# Altium project 6S_BMS.PrjPcb
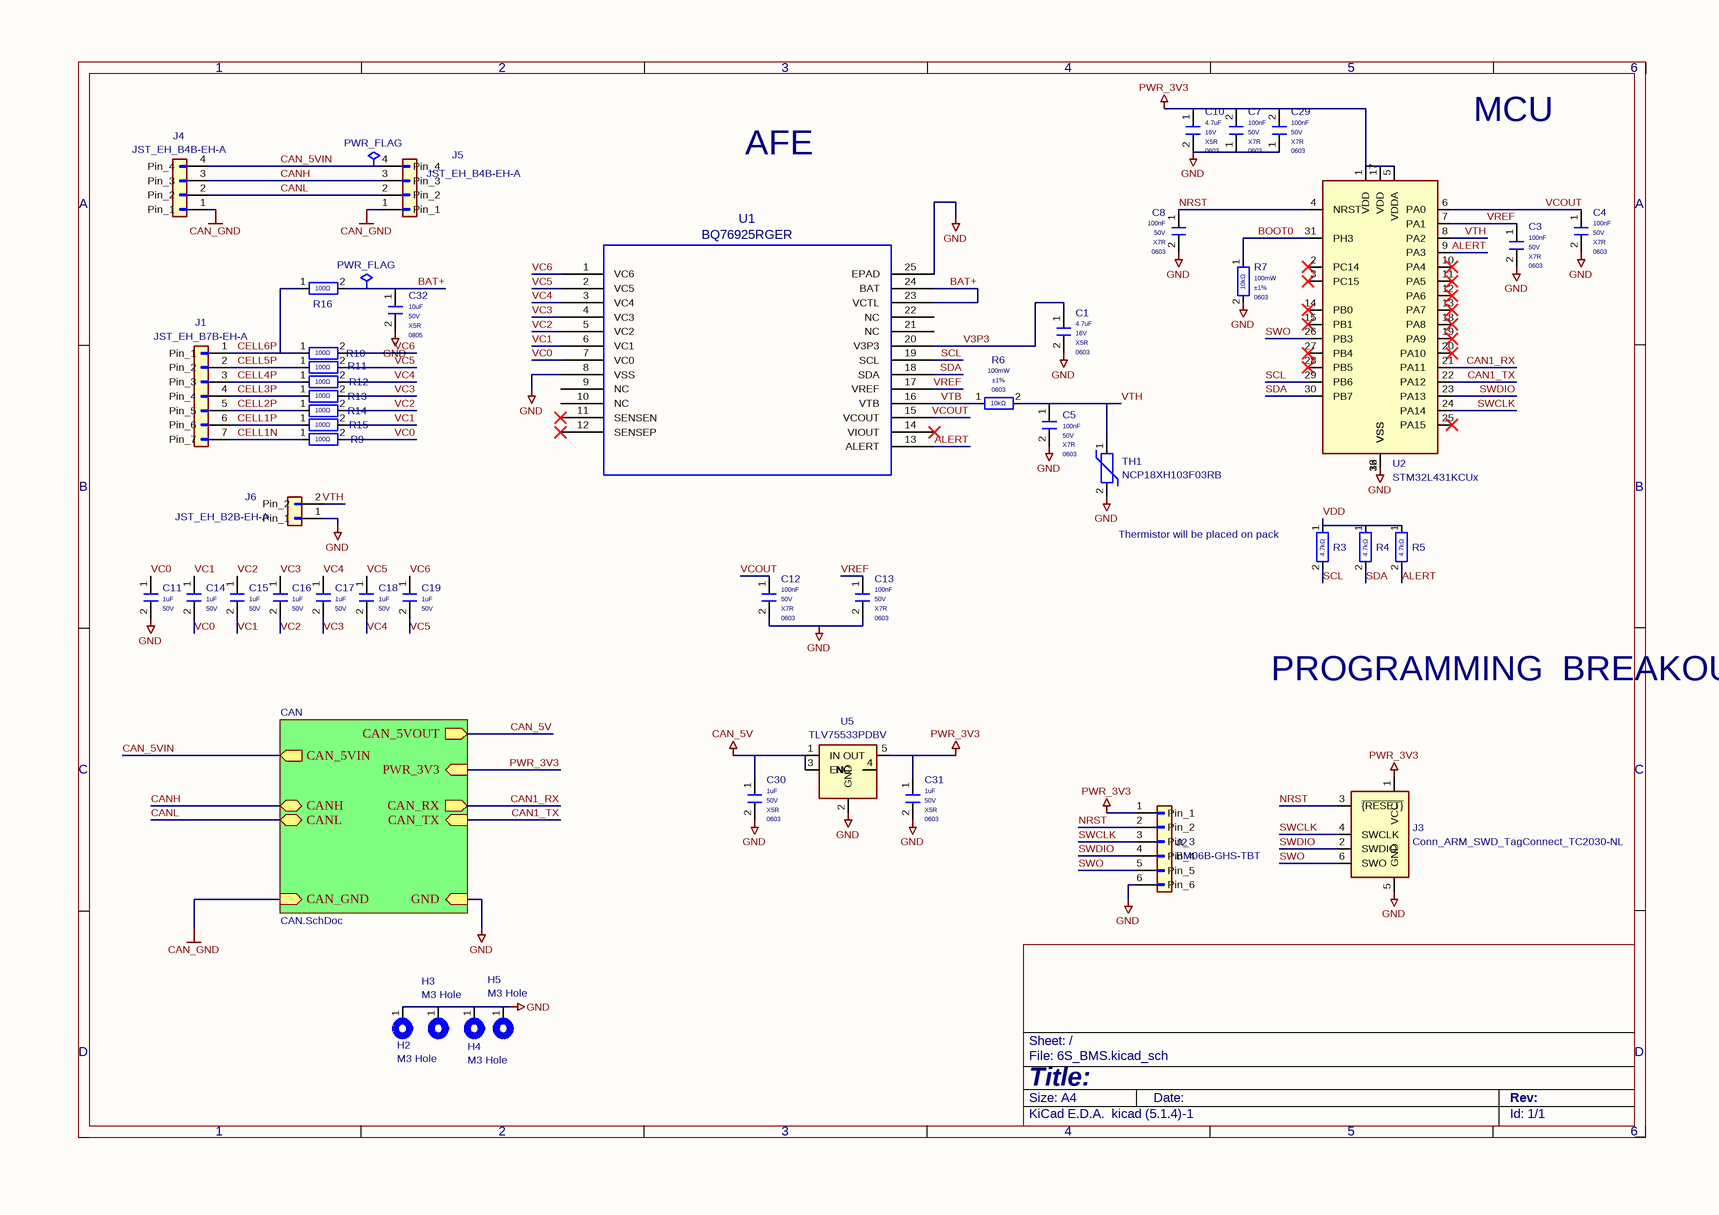
[diagram p0: 6S_BMS.SchDoc]
2 sheets, 67 parts. Net scope: hierarchical (ports join the sheet entries above them; power ports are global).
Sheets:
  6S_BMS.SchDoc
    CAN = CAN.SchDoc

## Sheet 6S_BMS.SchDoc
size 297 x 209 mm

### Parts
#FLG01  PWR_FLAG  (graphical)
#FLG02  PWR_FLAG  (graphical)
C1  Voltage Rated: 16V  Temperature Coefficient: X5R  Package: 0603  [C_0603]  (hidden comment: 4.7uF)
C3  Voltage Rated: 50V  Temperature Coefficient: X7R  Package: 0603  [C_0603]  (hidden comment: 100nF)
C4  Voltage Rated: 50V  Temperature Coefficient: X7R  Package: 0603  [C_0603]  (hidden comment: 100nF)
C5  Voltage Rated: 50V  Temperature Coefficient: X7R  Package: 0603  [C_0603]  (hidden comment: 100nF)
C7  Voltage Rated: 50V  Temperature Coefficient: X7R  Package: 0603  [C_0603]  (hidden comment: 100nF)
C8  Voltage Rated: 50V  Temperature Coefficient: X7R  Package: 0603  [C_0603]  (hidden comment: 100nF)
C10  Voltage Rated: 16V  Temperature Coefficient: X5R  Package: 0603  [C_0603]  (hidden comment: 4.7uF)
C11  Voltage Rated: 50V  [C_0603]  (hidden comment: 1uF)
C12  Voltage Rated: 50V  Temperature Coefficient: X7R  Package: 0603  [C_0603]  (hidden comment: 100nF)
C13  Voltage Rated: 50V  Temperature Coefficient: X7R  Package: 0603  [C_0603]  (hidden comment: 100nF)
C14  Voltage Rated: 50V  [C_0603]  (hidden comment: 1uF)
C15  Voltage Rated: 50V  [C_0603]  (hidden comment: 1uF)
C16  Voltage Rated: 50V  [C_0603]  (hidden comment: 1uF)
C17  Voltage Rated: 50V  [C_0603]  (hidden comment: 1uF)
C18  Voltage Rated: 50V  [C_0603]  (hidden comment: 1uF)
C19  Voltage Rated: 50V  [C_0603]  (hidden comment: 1uF)
C29  Voltage Rated: 50V  Temperature Coefficient: X7R  Package: 0603  [C_0603]  (hidden comment: 100nF)
C30  Voltage Rated: 50V  Temperature Coefficient: X5R  Package: 0603  [C_0603]  (hidden comment: 1uF)
C31  Voltage Rated: 50V  Temperature Coefficient: X5R  Package: 0603  [C_0603]  (hidden comment: 1uF)
C32  Voltage Rated: 50V  Temperature Coefficient: X5R  Package: 0805  [C_0805]  (hidden comment: 10uF)
H2  M3 Hole  [MountingHole_3.2mm_M3_Pad]
H3  M3 Hole  [MountingHole_3.2mm_M3_Pad]
H4  M3 Hole  [MountingHole_3.2mm_M3_Pad]
H5  M3 Hole  [MountingHole_3.2mm_M3_Pad]
J1  JST_EH_B7B-EH-A  [JST_EH_B7B-EH-A_1x07_P2.50mm_Vertical]
J2  BM06B-GHS-TBT  [Hirose_DF13-06P-1.25DSA_1x06_P1.25mm_Vertical]
J3  Conn_ARM_SWD_TagConnect_TC2030-NL  [Tag-Connect_TC2030-IDC-NL_2x03_P1.27mm_Vertical]
J4  JST_EH_B4B-EH-A  [JST_EH_B4B-EH-A_1x04_P2.50mm_Vertical]
J5  JST_EH_B4B-EH-A  [JST_EH_B4B-EH-A_1x04_P2.50mm_Vertical]
J6  JST_EH_B2B-EH-A  [JST_EH_B2B-EH-A_1x02_P2.50mm_Vertical]
R3  4.7kΩ  [R_0603]
R4  4.7kΩ  [R_0603]
R5  4.7kΩ  [R_0603]
R6  Power(Watts): 100mW  Tolerance: ±1%  Package: 0603  [R_0603]  (hidden comment: 10kΩ)
R7  Power(Watts): 100mW  Tolerance: ±1%  Package: 0603  [R_0603]  (hidden comment: 10kΩ)
R9  100Ω  [R_0603]
R10  100Ω  [R_0603]
R11  100Ω  [R_0603]
R12  100Ω  [R_0603]
R13  100Ω  [R_0603]
R14  100Ω  [R_0603]
R15  100Ω  [R_0603]
R16  100Ω  [R_0603]
TH1  NCP18XH103F03RB
U1  BQ76925RGER  [RGE24_2P45X2P45]
U2  STM32L431KCUx  [QFN-32-1EP_5x5mm_P0.5mm_EP3.45x3.45mm]
U5  TLV75533PDBV  [SOT-23-5]

### Sub-sheets
CAN = CAN.SchDoc: CANH (bidir), CANL (bidir), CAN_5VIN (out), CAN_5VOUT (out), CAN_GND (in), CAN_RX (out), CAN_TX (in), GND (in), PWR_3V3 (in)

### Nets
CAN_5V: C30.1 U5.1(IN) U5.3(EN) ; sheet CAN/CAN_5VOUT
CAN_5VIN: #FLG01.1 J4.4(Pin_4) J5.4(Pin_4) ; sheet CAN/CAN_5VIN
CAN_GND: J4.1(Pin_1) J5.1(Pin_1) ; sheet CAN/CAN_GND
GND: C1.2 C3.2 C4.2 C5.2 C7.1 C8.2 C10.2 C11.2 C12.2 C13.2 C29.1 C30.2 C31.2 C32.2 H2.1 H3.1 H4.1 H5.1 J2.6(Pin_6) J3.5(GND) J6.1(Pin_1) R7.2 TH1.2 U1.8(VSS) U1.25(EPAD) U2.16(VSS) U2.32(VSS) U2.33(VSS) U5.2(GND) ; sheet CAN/GND
PWR_3V3: C7.2 C10.1 C29.2 C31.1 J2.1(Pin_1) J3.1(VCC) U2.1(VDD) U2.5(VDDA) U2.17(VDD) U5.5(OUT) ; sheet CAN/PWR_3V3
ALERT: R5.2 U1.13(ALERT) U2.9(PA3)
BAT+: #FLG02.1 C32.1 R16.2 U1.23(VCTL) U1.24(BAT)
BOOT0: R7.1 U2.31(PH3)
CAN1_RX: U2.21(PA11) ; sheet CAN/CAN_RX
CAN1_TX: U2.22(PA12) ; sheet CAN/CAN_TX
CANH: J4.3(Pin_3) J5.3(Pin_3) ; sheet CAN/CANH
CANL: J4.2(Pin_2) J5.2(Pin_2) ; sheet CAN/CANL
CELL1N: J1.7(Pin_7) R9.1
CELL1P: J1.6(Pin_6) R15.1
CELL2P: J1.5(Pin_5) R14.1
CELL3P: J1.4(Pin_4) R13.1
CELL4P: J1.3(Pin_3) R12.1
CELL5P: J1.2(Pin_2) R11.1
CELL6P: J1.1(Pin_1) R10.1 R16.1
NRST: C8.1 J2.2(Pin_2) J3.3(~{{RESET}}) U2.4(NRST)
SCL: R3.2 U1.19(SCL) U2.29(PB6)
SDA: R4.2 U1.18(SDA) U2.30(PB7)
SWCLK: J2.3(Pin_3) J3.4(SWCLK) U2.24(PA14)
SWDIO: J2.4(Pin_4) J3.2(SWDIO) U2.23(PA13)
SWO: J2.5(Pin_5) J3.6(SWO) U2.26(PB3)
V3P3: C1.1 U1.20(V3P3)
VC0: C11.1 C14.2 R9.2 U1.7(VC0)
VC1: C14.1 C15.2 R15.2 U1.6(VC1)
VC2: C15.1 C16.2 R14.2 U1.5(VC2)
VC3: C16.1 C17.2 R13.2 U1.4(VC3)
VC4: C17.1 C18.2 R12.2 U1.3(VC4)
VC5: C18.1 C19.2 R11.2 U1.2(VC5)
VC6: C19.1 R10.2 U1.1(VC6)
VCOUT: C4.1 C12.1 U1.15(VCOUT) U2.6(PA0)
VDD: R3.1 R4.1 R5.1
VREF: C3.1 C13.1 U1.17(VREF) U2.7(PA1)
VTB: R6.1 U1.16(VTB)
VTH: C5.1 J6.2(Pin_2) R6.2 TH1.1 U2.8(PA2)

Not connected (* = marked no-connect by the designer): U1 9(NC) 10(NC) 11(SENSEN)* 12(SENSEP)* 14(VIOUT)* 21(NC) 22(NC); U2 2(PC14)* 3(PC15)* 10(PA4)* 11(PA5)* 12(PA6)* 13(PA7)* 14(PB0)* 15(PB1)* 18(PA8)* 19(PA9)* 20(PA10)* 25(PA15)* 27(PB4)* 28(PB5)*; U5 4(NC)

### Notes on the sheet
- MCU
- AFE
- Thermistor will be placed on pack
- PROGRAMMING
  BREAKOUT
- 1
- 2
- 3
- 4
- 5
- 6
- A
- B
- C
- D
- Title:
- File: 6S_BMS.kicad_sch
- Sheet: /
- KiCad E.D.A.  kicad (5.1.4)-1
- Size: A4
- Date:
- Rev:
- Id: 1/1

### Library data of the parts
#FLG01 #FLG02 = PWR_FLAG: Description: Special symbol for telling ERC where power comes from; Value: PWR_FLAG
C1 C10 = 0603,4.7uF: Manufacturer: Samsung Electro-Mechanics; Part: CL10A475KO8NNNC; Description: 16V 4.7uF X5R ±10% 0603 Multilayer Ceramic Capacitors MLCC - SMD/SMT ROHS; Process: SMT; Minimum Qty: 20; Attrition Qty: 10; Class: Basic Component; Tolerance: ±10%; LCSC: C19666; Stock: 4246728; Price: 0.013USD; Category: Capacitors,Multilayer Ceramic Capacitors MLCC - SMD/SMT; Capacitance: 4.7uF; Value: 4.7uF; Footprint: PCM_JLCPCB:C_0603
C3-C5 C7 C8 C12 C13 C29 = 0603,100nF: Manufacturer: YAGEO; Part: CC0603KRX7R9BB104; Description: 50V 100nF X7R ±10% 0603 Multilayer Ceramic Capacitors MLCC - SMD/SMT ROHS; Process: SMT; Minimum Qty: 20; Attrition Qty: 10; Class: Basic Component; Tolerance: ±10%; LCSC: C14663; Stock: 70324515; Price: 0.006USD; Category: Capacitors,Multilayer Ceramic Capacitors MLCC - SMD/SMT; Capacitance: 100nF; Value: 100nF; Footprint: PCM_JLCPCB:C_0603
C11 C14-C19 = 0603,1uF: Manufacturer: Samsung Electro-Mechanics; Part: CL10A105KB8NNNC; Description: 50V 1uF X5R ±10% 0603 Multilayer Ceramic Capacitors MLCC - SMD/SMT ROHS; Process: SMT; Minimum Qty: 20; Attrition Qty: 10; Class: Basic Component; Tolerance: ±10%; Temperature Coefficient: X5R; LCSC: C15849; Stock: 11535980; Price: 0.008USD; Category: Capacitors,Multilayer Ceramic Capacitors MLCC - SMD/SMT; Capacitance: 1uF; Value: 1uF; Footprint: PCM_JLCPCB:C_0603
C30 C31 = 0603,1uF: Manufacturer: Samsung Electro-Mechanics; Part: CL10A105KB8NNNC; Description: 50V 1uF X5R ±10% 0603 Multilayer Ceramic Capacitors MLCC - SMD/SMT ROHS; Process: SMT; Minimum Qty: 20; Attrition Qty: 10; Class: Basic Component; Tolerance: ±10%; LCSC: C15849; Stock: 11535980; Price: 0.008USD; Category: Capacitors,Multilayer Ceramic Capacitors MLCC - SMD/SMT; Capacitance: 1uF; Value: 1uF; Footprint: PCM_JLCPCB:C_0603
C32 = 0805,10uF,(2): Manufacturer: Murata Electronics; Part: GRM21BR61H106KE43L; Description: 50V 10uF X5R ±10% 0805 Multilayer Ceramic Capacitors MLCC - SMD/SMT ROHS; Process: SMT; Minimum Qty: 5; Attrition Qty: 4; Class: Basic Component; Tolerance: ±10%; LCSC: C440198; Stock: 1422246; Price: 0.066USD; Category: Capacitors,Multilayer Ceramic Capacitors MLCC - SMD/SMT; Capacitance: 10uF; Value: 10uF; Footprint: PCM_JLCPCB:C_0805
H2-H5 = MountingHole_Pad: Description: Mounting Hole with connection; Value: M3 Hole; Footprint: MountingHole:MountingHole_3.2mm_M3_Pad
J1 = Conn_01x07: Description: Generic connector, single row, 01x07, script generated (kicad-library-utils/schlib/autogen/connector/); Value: JST_EH_B7B-EH-A; Footprint: Connector_JST:JST_EH_B7B-EH-A_1x07_P2.50mm_Vertical
J2 = Conn_01x06: Description: Generic connector, single row, 01x06, script generated (kicad-library-utils/schlib/autogen/connector/); Value: BM06B-GHS-TBT; Footprint: Connector_Hirose:Hirose_DF13-06P-1.25DSA_1x06_P1.25mm_Vertical
J3 = Conn_ARM_SWD_TagConnect_TC2030-NL: Description: Tag-Connect ARM Cortex SWD JTAG connector, 6 pin, no legs; Value: Conn_ARM_SWD_TagConnect_TC2030-NL; Footprint: Connector:Tag-Connect_TC2030-IDC-NL_2x03_P1.27mm_Vertical
J4 J5 = Conn_01x04: Description: Generic connector, single row, 01x04, script generated (kicad-library-utils/schlib/autogen/connector/); Value: JST_EH_B4B-EH-A; Footprint: Connector_JST:JST_EH_B4B-EH-A_1x04_P2.50mm_Vertical
J6 = Conn_01x02: Description: Generic connector, single row, 01x02, script generated (kicad-library-utils/schlib/autogen/connector/); Value: JST_EH_B2B-EH-A; Footprint: Connector_JST:JST_EH_B2B-EH-A_1x02_P2.50mm_Vertical
R3-R5 = 0603,4.7kΩ: Manufacturer: UNI-ROYAL(Uniroyal Elec); Part: 0603WAF4701T5E; Description: 100mW Thick Film Resistors 75V ±100ppm/°C ±1% 4.7kΩ 0603 Chip Resistor - Surface Mount ROHS; Process: SMT; Minimum Qty: 20; Attrition Qty: 10; Class: Basic Component; Power(Watts): 100mW; Overload Voltage (Max): 75V; Tolerance: ±1%; Temperature Coefficient: ±100ppm/°C; LCSC: C23162; Stock: 11302490; Price: 0.004USD; Category: Resistors,Chip Resistor - Surface Mount; Resistance: 4.7kΩ; Type: Thick Film Resistors; Operating Temperature Range: -55°C~+155°C; Value: 4.7kΩ; Footprint: PCM_JLCPCB:R_0603
R6 R7 = 0603,10kΩ: Manufacturer: UNI-ROYAL(Uniroyal Elec); Part: 0603WAF1002T5E; Description: 100mW Thick Film Resistors 75V ±100ppm/°C ±1% 10kΩ 0603 Chip Resistor - Surface Mount ROHS; Process: SMT; Minimum Qty: 20; Attrition Qty: 10; Class: Basic Component; Overload Voltage (Max): 75V; Temperature Coefficient: ±100ppm/°C; LCSC: C25804; Stock: 51181774; Price: 0.004USD; Category: Resistors,Chip Resistor - Surface Mount; Resistance: 10kΩ; Type: Thick Film Resistors; Operating Temperature Range: -55°C~+155°C; Value: 10kΩ; Footprint: PCM_JLCPCB:R_0603
R9-R16 = 0603,100Ω: Manufacturer: UNI-ROYAL(Uniroyal Elec); Part: 0603WAF1000T5E; Description: 100mW Thick Film Resistors 75V ±1% ±200ppm/°C 100Ω 0603 Chip Resistor - Surface Mount ROHS; Process: SMT; Minimum Qty: 20; Attrition Qty: 10; Class: Basic Component; Power(Watts): 100mW; Overload Voltage (Max): 75V; Tolerance: ±1%; Temperature Coefficient: ±200ppm/°C; LCSC: C22775; Stock: 8202320; Price: 0.004USD; Category: Resistors,Chip Resistor - Surface Mount; Resistance: 100Ω; Type: Thick Film Resistors; Operating Temperature Range: -55°C~+155°C; Value: 100Ω; Footprint: PCM_JLCPCB:R_0603
TH1 = Thermistor: Description: Temperature dependent resistor; Value: NCP18XH103F03RB
U2 = STM32L431KCUx: Description: STMicroelectronics Arm Cortex-M4 MCU, 256KB flash, 64KB RAM, 80 MHz, 1.71-3.6V, 26 GPIO, UFQFPN32; Value: STM32L431KCUx; Footprint: Package_DFN_QFN:QFN-32-1EP_5x5mm_P0.5mm_EP3.45x3.45mm
U5 = TLV75533PDBV: Description: 500mA Low Dropout Voltage Regulator, Fixed Output 3.3V, SOT-23-5; Value: TLV75533PDBV; Footprint: Package_TO_SOT_SMD:SOT-23-5
U1 = BQ76925RGER: Value: BQ76925RGER; Footprint: BQ76:RGE24_2P45X2P45

## Sheet CAN.SchDoc
size 297 x 209 mm
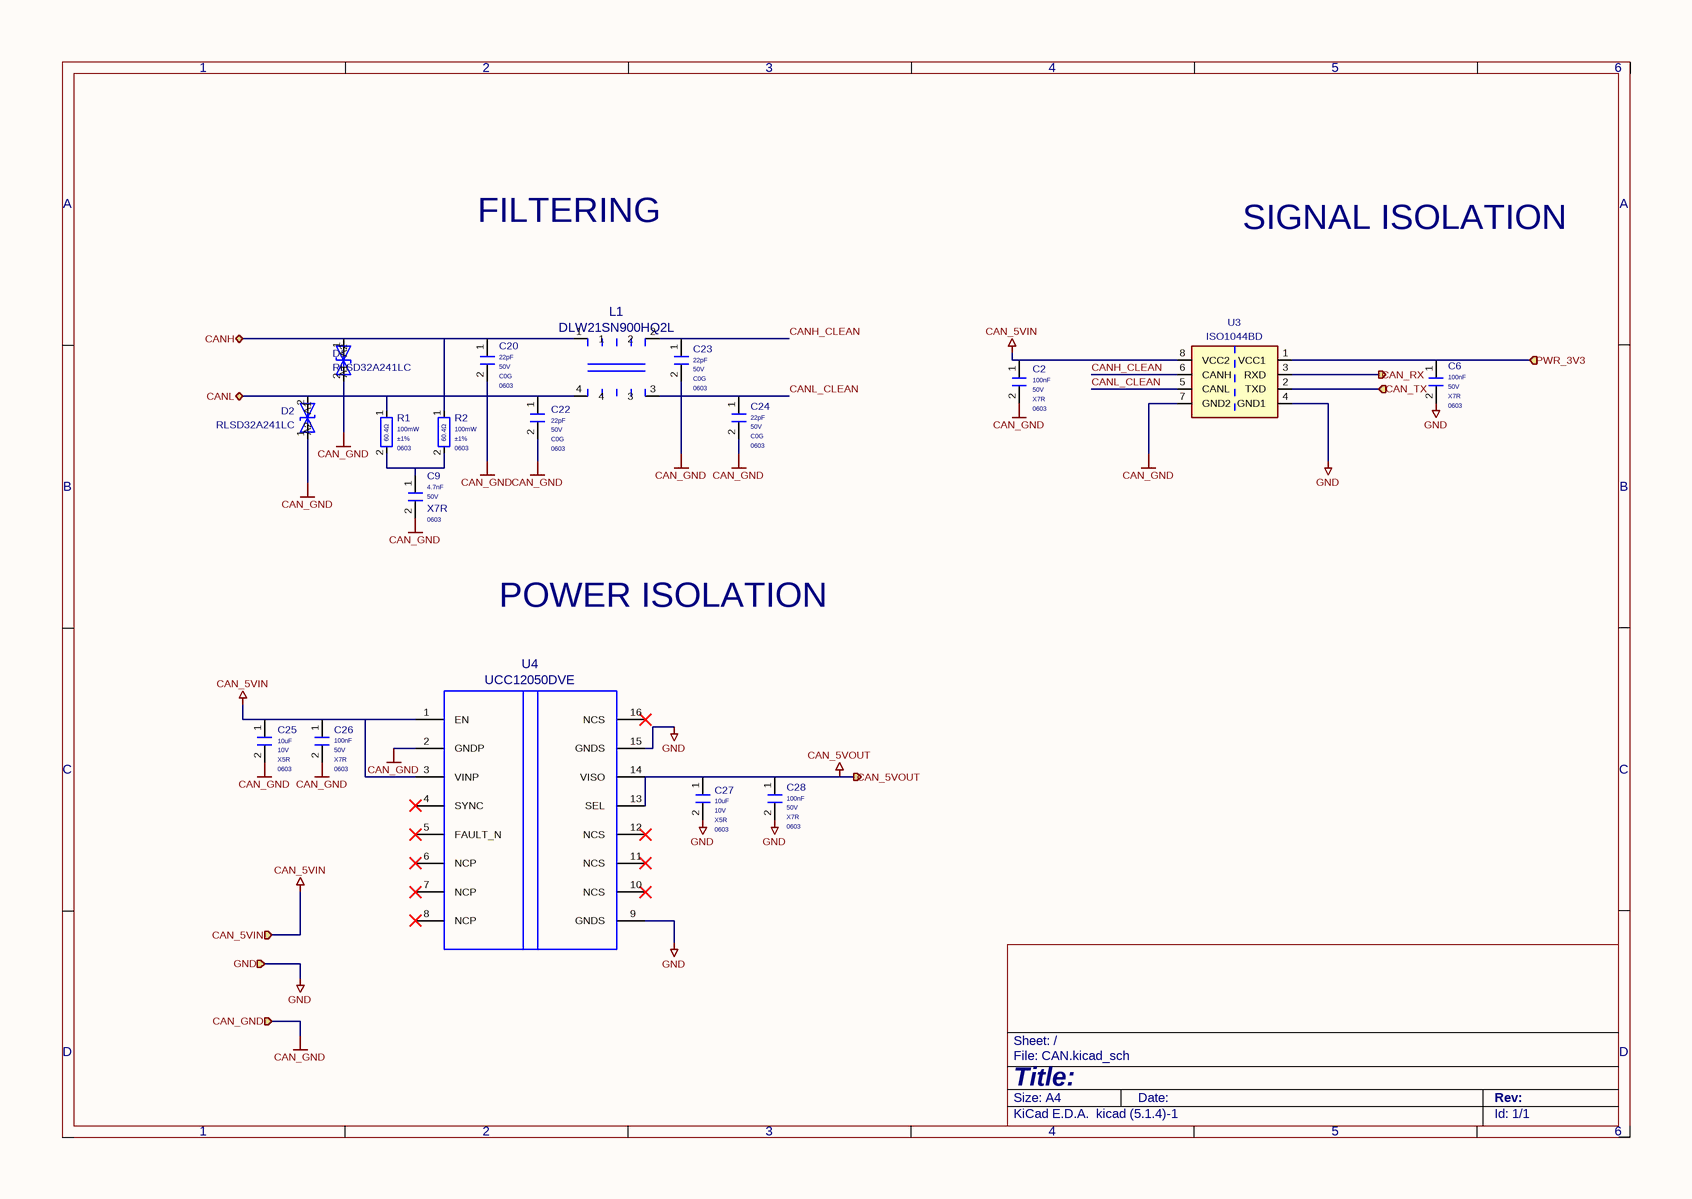
[diagram p1: CAN.SchDoc]

### Parts
C2  Voltage Rated: 50V  Temperature Coefficient: X7R  Package: 0603  [C_0603]  (hidden comment: 100nF)
C6  Voltage Rated: 50V  Temperature Coefficient: X7R  Package: 0603  [C_0603]  (hidden comment: 100nF)
C9  Voltage Rated: 50V  Temperature Coefficient: X7R  Package: 0603  [C_0603]  (hidden comment: 4.7nF)
C20  Voltage Rated: 50V  Temperature Coefficient: C0G  Package: 0603  [C_0603]  (hidden comment: 22pF)
C22  Voltage Rated: 50V  Temperature Coefficient: C0G  Package: 0603  [C_0603]  (hidden comment: 22pF)
C23  Voltage Rated: 50V  Temperature Coefficient: C0G  Package: 0603  [C_0603]  (hidden comment: 22pF)
C24  Voltage Rated: 50V  Temperature Coefficient: C0G  Package: 0603  [C_0603]  (hidden comment: 22pF)
C25  Voltage Rated: 10V  Temperature Coefficient: X5R  Package: 0603  [C_0603]  (hidden comment: 10uF)
C26  Voltage Rated: 50V  Temperature Coefficient: X7R  Package: 0603  [C_0603]  (hidden comment: 100nF)
C27  Voltage Rated: 10V  Temperature Coefficient: X5R  Package: 0603  [C_0603]  (hidden comment: 10uF)
C28  Voltage Rated: 50V  Temperature Coefficient: X7R  Package: 0603  [C_0603]  (hidden comment: 100nF)
D1  RLSD32A241LC  [D_SOD-323]
D2  RLSD32A241LC  [D_SOD-323]
L1  DLW21SN900HQ2L  [IND_DLW21S_0805_MUR]
R1  Power(Watts): 100mW  Tolerance: ±1%  Package: 0603  [R_0603]  (hidden comment: 60.4Ω)
R2  Power(Watts): 100mW  Tolerance: ±1%  Package: 0603  [R_0603]  (hidden comment: 60.4Ω)
U3  ISO1044BD  [SOIC-8_3.9x4.9mm_P1.27mm]
U4  UCC12050DVE  [DVE0016A]

### Ports
CAN_5VIN (in), CAN_5VOUT (out), CAN_GND (in), CAN_RX (out), CAN_TX (in), CANH (bidir), CANL (bidir), GND (in), PWR_3V3 (in)

### Nets
CAN_5VIN: C2.1 C25.1 C26.1 U3.8(VCC2) U4.1(EN) U4.3(VINP) ; port CAN_5VIN
CAN_5VOUT: C27.1 C28.1 U4.13(SEL) U4.14(VISO) ; port CAN_5VOUT  [project net CAN_5V]
CAN_GND: C2.2 C9.2 C20.2 C22.2 C23.2 C24.2 C25.2 C26.2 D1.2(A2) D2.1(A1) U3.7(GND2) U4.2(GNDP) ; port CAN_GND
GND: C6.2 C27.2 C28.2 U3.4(GND1) U4.9(GNDS) U4.15(GNDS) ; port GND
PWR_3V3: C6.1 U3.1(VCC1) ; port PWR_3V3
CAN1_RX: U3.3(RXD) ; port CAN_RX
CAN1_TX: U3.2(TXD) ; port CAN_TX
CANH: C20.1 D1.1(A1) L1.1 R2.1 ; port CANH
CANH_CLEAN: C23.1 L1.2 U3.6(CANH)
CANL: C22.1 D2.2(A2) L1.4 R1.1 ; port CANL
CANL_CLEAN: C24.1 L1.3 U3.5(CANL)
NetC9_1: C9.1 R1.2 R2.2

Not connected (* = marked no-connect by the designer): U4 4(SYNC)* 5(FAULT_N)* 6(NCP)* 7(NCP)* 8(NCP)* 10(NCS)* 11(NCS)* 12(NCS)* 16(NCS)*

### Notes on the sheet
- FILTERING
- SIGNAL ISOLATION
- POWER ISOLATION
- 1
- 2
- 3
- 4
- 5
- 6
- A
- B
- C
- D
- Title:
- File: CAN.kicad_sch
- Sheet: /
- KiCad E.D.A.  kicad (5.1.4)-1
- Size: A4
- Date:
- Rev:
- Id: 1/1

### Library data of the parts
C2 C6 C26 C28 = 0603,100nF: as C3 on sheet 6S_BMS; LCSC: C14663; Stock: 70324515; Price: 0.006USD; Category: Capacitors,Multilayer Ceramic Capacitors MLCC - SMD/SMT; Capacitance: 100nF; Value: 100nF; Footprint: PCM_JLCPCB:C_0603
C9 = 0603,4.7nF: Manufacturer: FH(Guangdong Fenghua Advanced Tech); Part: 0603B472K500NT; Description: 50V 4.7nF X7R ±10% 0603 Multilayer Ceramic Capacitors MLCC - SMD/SMT ROHS; Process: SMT; Minimum Qty: 20; Attrition Qty: 10; Class: Basic Component; Tolerance: ±10%; LCSC: C53987; Stock: 745383; Price: 0.006USD; Category: Capacitors,Multilayer Ceramic Capacitors MLCC - SMD/SMT; Capacitance: 4.7nF; Value: 4.7nF; Footprint: PCM_JLCPCB:C_0603
C20 C22-C24 = 0603,22pF: Manufacturer: Samsung Electro-Mechanics; Part: CL10C220JB8NNNC; Description: 50V 22pF C0G ±5% 0603 Multilayer Ceramic Capacitors MLCC - SMD/SMT ROHS; Process: SMT; Minimum Qty: 20; Attrition Qty: 10; Class: Basic Component; Tolerance: ±5%; LCSC: C1653; Stock: 1531147; Price: 0.007USD; Category: Capacitors,Multilayer Ceramic Capacitors MLCC - SMD/SMT; Capacitance: 22pF; Value: 22pF; Footprint: PCM_JLCPCB:C_0603
C25 C27 = 0603,10uF: Manufacturer: Samsung Electro-Mechanics; Part: CL10A106KP8NNNC; Description: 10V 10uF X5R ±10% 0603 Multilayer Ceramic Capacitors MLCC - SMD/SMT ROHS; Process: SMT; Minimum Qty: 20; Attrition Qty: 10; Class: Basic Component; Tolerance: ±10%; LCSC: C19702; Stock: 9881407; Price: 0.009USD; Category: Capacitors,Multilayer Ceramic Capacitors MLCC - SMD/SMT; Capacitance: 10uF; Value: 10uF; Footprint: PCM_JLCPCB:C_0603
D1 D2 = D_TVS: Description: Bidirectional transient-voltage-suppression diode; Value: RLSD32A241LC; Footprint: PCM_JLCPCB:D_SOD-323
R1 R2 = 0603,56Ω: Manufacturer: UNI-ROYAL(Uniroyal Elec); Part: 0603WAF560JT5E; Description: 100mW Thick Film Resistors 75V ±1% ±200ppm/°C 56Ω 0603 Chip Resistor - Surface Mount ROHS; Process: SMT; Minimum Qty: 20; Attrition Qty: 10; Class: Preferred Component; Resistance: 56Ω; Overload Voltage (Max): 75V; Temperature Coefficient: ±200ppm/°C; LCSC: C25196; Stock: 115138; Price: 0.004USD; Category: Resistors,Chip Resistor - Surface Mount; Type: Thick Film Resistors; Operating Temperature Range: -55°C~+155°C; Value: 60.4Ω; Footprint: PCM_JLCPCB:R_0603
U3 = ISO1044BD: Description: Isolated CAN FD Transceiver, SOIC-8; Value: ISO1044BD; Footprint: Package_SO:SOIC-8_3.9x4.9mm_P1.27mm
L1 = DLW21SN900HQ2L: Value: DLW21SN900HQ2L; Footprint: DLW21:IND_DLW21S_0805_MUR
U4 = UCC12050DVE: Value: UCC12050DVE; Footprint: UCC12:DVE0016A

## Nets that join several sheets
CAN_5V: 6S_BMS (C30.1 U5.1 U5.3), CAN (C27.1 C28.1 U4.13 U4.14)
CAN_5VIN: 6S_BMS (#FLG01.1 J4.4 J5.4), CAN (6 pins)
CAN_GND: 6S_BMS (J4.1 J5.1), CAN (12 pins)
GND: 6S_BMS (29 pins), CAN (6 pins)
PWR_3V3: 6S_BMS (10 pins), CAN (C6.1 U3.1)
CAN1_RX: 6S_BMS (U2.21), CAN (U3.3)
CAN1_TX: 6S_BMS (U2.22), CAN (U3.2)
CANH: 6S_BMS (J4.3 J5.3), CAN (C20.1 D1.1 L1.1 R2.1)
CANL: 6S_BMS (J4.2 J5.2), CAN (C22.1 D2.2 L1.4 R1.1)